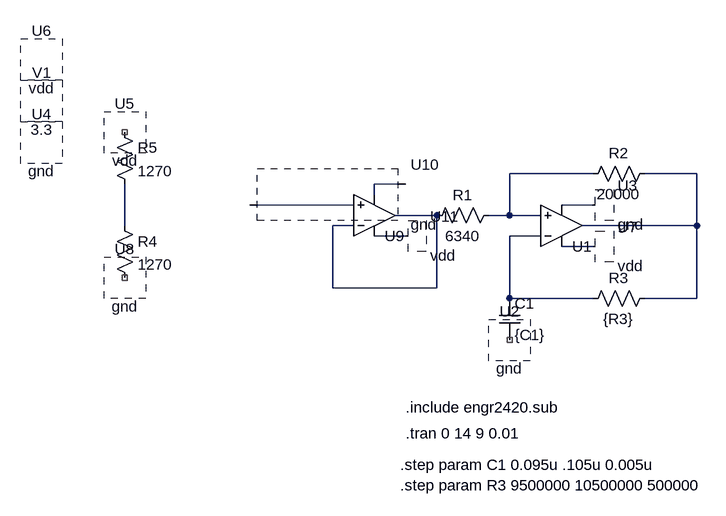
[diagram p0: schematic attempt1_validate.asc]
attempt1_validate.asc, the LTspice schematic file:
Version 4
SHEET 1 880 680
WIRE 160 144 32 144
WIRE 320 144 240 144
WIRE -128 160 -176 160
WIRE -176 176 -176 160
WIRE -560 224 -560 160
WIRE -208 192 -368 192
WIRE 160 192 112 192
WIRE -80 208 -144 208
WIRE 32 208 32 144
WIRE 32 208 0 208
WIRE 80 208 32 208
WIRE -208 224 -240 224
WIRE 320 224 320 144
WIRE 320 224 144 224
WIRE -128 240 -176 240
WIRE 80 240 32 240
WIRE 160 256 112 256
WIRE -240 320 -240 224
WIRE -80 320 -80 208
WIRE -80 320 -240 320
WIRE 32 336 32 240
WIRE 160 336 32 336
WIRE 320 336 320 224
WIRE 320 336 240 336
SYMBOL Opamps\\UniversalOpamp2 112 224 M180
SYMATTR InstName U1
SYMBOL cktsym\\vsource -688 32 R0
SYMATTR Value 3.3
SYMATTR InstName V1
SYMBOL res 16 192 R90
WINDOW 0 0 56 VBottom 2
WINDOW 3 32 56 VTop 2
SYMATTR InstName R1
SYMATTR Value 6340
SYMATTR SpiceLine tol=1
SYMBOL res 256 128 R90
WINDOW 0 0 56 VBottom 2
WINDOW 3 32 56 VTop 2
SYMATTR InstName R2
SYMATTR Value 20000
SYMATTR SpiceLine tol=1
SYMBOL res 256 320 R90
WINDOW 0 0 56 VBottom 2
WINDOW 3 32 56 VTop 2
SYMATTR InstName R3
SYMATTR Value {R3}
SYMATTR SpiceLine tol=1
SYMBOL cktsym\\gnd 160 192 R0
SYMATTR InstName U3
SYMBOL cktsym\\gnd -688 96 R0
SYMATTR InstName U4
SYMBOL cktsym\\vdd -688 -32 R0
SYMATTR InstName U6
SYMBOL cktsym\\vdd 160 256 R0
SYMATTR InstName U7
SYMBOL cap 16 336 R0
SYMATTR InstName C1
SYMATTR Value {C1}
SYMBOL cktsym\\gnd 32 400 R0
SYMATTR InstName U2
SYMBOL res -576 208 R0
SYMATTR InstName R4
SYMATTR Value 1270
SYMATTR SpiceLine tol=1
SYMBOL res -576 64 R0
SYMATTR InstName R5
SYMATTR Value 1270
SYMATTR SpiceLine tol=1
SYMBOL cktsym\\vdd -560 80 R0
SYMATTR InstName U5
SYMBOL cktsym\\gnd -560 304 R0
SYMATTR InstName U8
SYMBOL Opamps\\UniversalOpamp2 -176 208 M180
SYMATTR InstName U9
SYMBOL cktsym\\gnd -128 160 R0
SYMATTR InstName U10
SYMBOL cktsym\\vdd -128 240 R0
SYMATTR InstName U11
TEXT -128 504 Left 2 !.include engr2420.sub
TEXT -128 544 Left 2 !.tran 0 14 9 0.01
TEXT -136 592 Left 2 !.step param C1 0.095u .105u 0.005u
TEXT -136 624 Left 2 !.step param R3 9500000 10500000 500000

The netlist it stands for:
* attempt1_validate.asc
XU1 N001 N009 N010 N006 N002 level.2 Avol=1Meg GBW=10Meg Slew=10Meg ilimit=25m rail=0 Vos=0 phimargin=45 en=0 enk=0 in=0 ink=0 Rin=500Meg  ; pins IN+ IN- V+ V- OUT
* V1: 3.3 (symbol cktsym\vsource not available, pin order unknown); nets seen at it: 
R1 N001 N007 6340 tol=1
R2 N002 N001 20000 tol=1
R3 N002 N009 {R3} tol=1
* U3: gnd (symbol cktsym\gnd not available, pin order unknown); nets seen at it: N006
* U4: gnd (symbol cktsym\gnd not available, pin order unknown); nets seen at it: 
* U6: vdd (symbol cktsym\vdd not available, pin order unknown); nets seen at it: 
* U7: vdd (symbol cktsym\vdd not available, pin order unknown); nets seen at it: N010
C1 N009 NC_01 {C1}
* U2: gnd (symbol cktsym\gnd not available, pin order unknown); nets seen at it: 
R4 N004 NC_02 1270 tol=1
R5 NC_03 N004 1270 tol=1
* U5: vdd (symbol cktsym\vdd not available, pin order unknown); nets seen at it: 
* U8: gnd (symbol cktsym\gnd not available, pin order unknown); nets seen at it: 
XU9 N005 N007 N008 N003 N007 level.2 Avol=1Meg GBW=10Meg Slew=10Meg ilimit=25m rail=0 Vos=0 phimargin=45 en=0 enk=0 in=0 ink=0 Rin=500Meg  ; pins IN+ IN- V+ V- OUT
* U10: gnd (symbol cktsym\gnd not available, pin order unknown); nets seen at it: N003, N005
* U11: vdd (symbol cktsym\vdd not available, pin order unknown); nets seen at it: N008
.include engr2420.sub
.tran 0 14 9 0.01
.step param C1 0.095u .105u 0.005u
.step param R3 9500000 10500000 500000
.lib UniversalOpamps2.sub
.backanno
.end